# Altium schematic sheet Channel_1.SchDoc
size A4
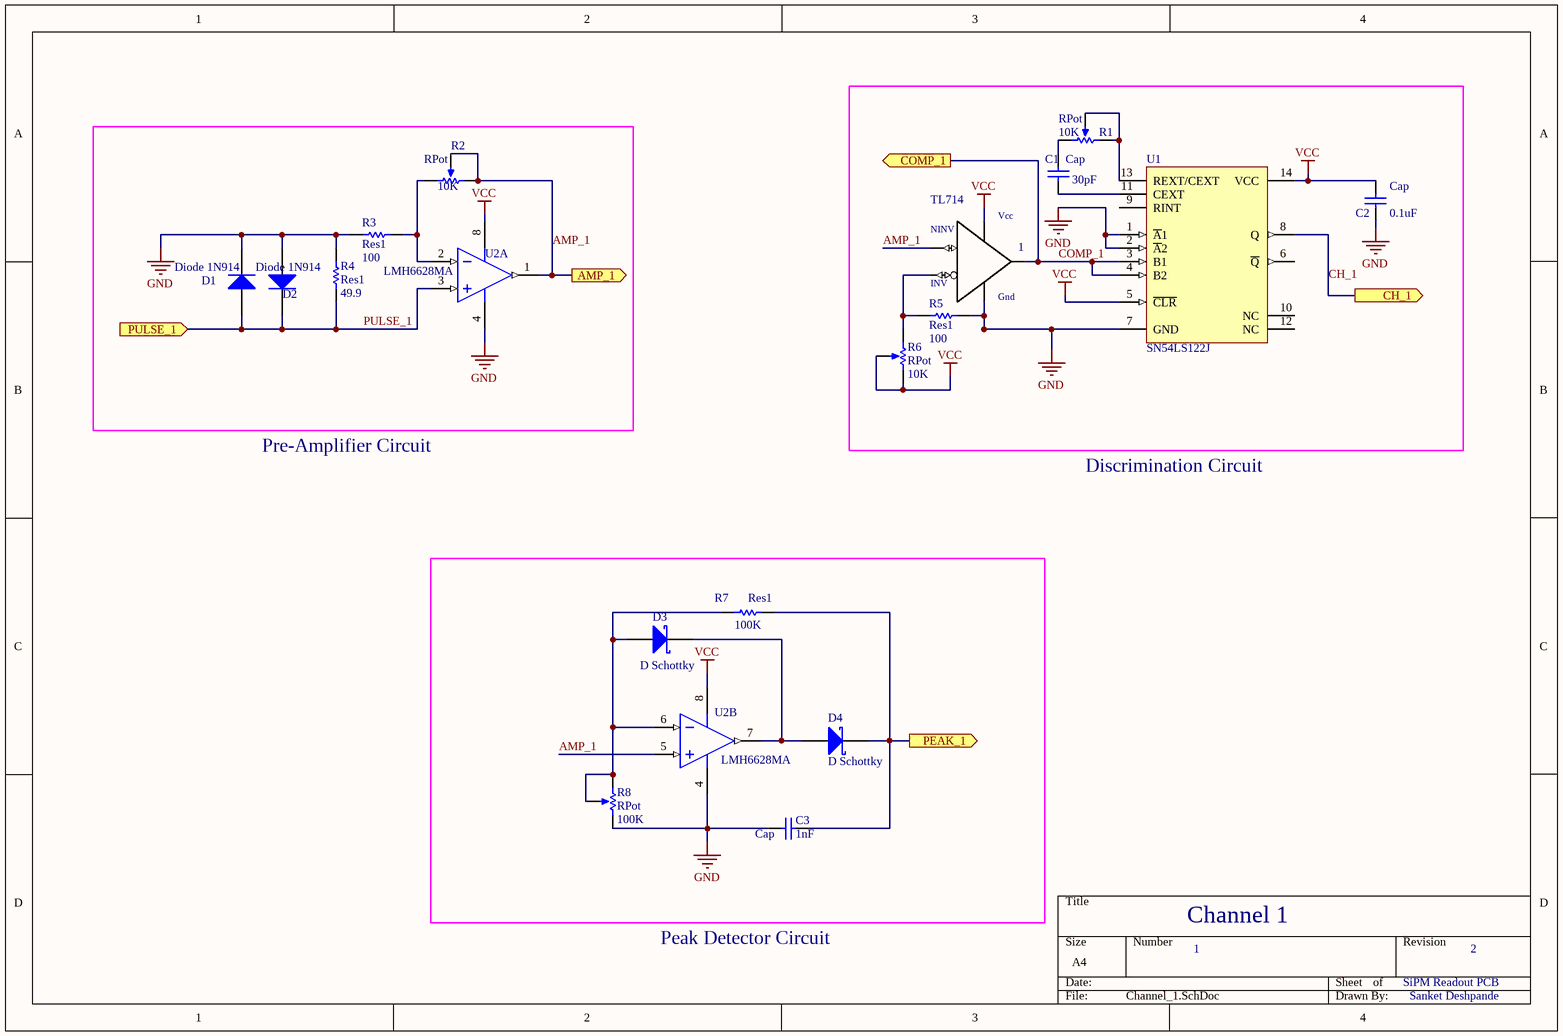
[diagram p0: Channel_1.SchDoc]

## Parts
1  TL714  [SO-08M]
C1  Cap  value 30pF  [RAD-0.3]
C2  Cap  value 0.1uF  [RAD-0.3]
C3  Cap  value 1nF  [RAD-0.3]
D1  Diode 1N914  [DO-35]
D2  Diode 1N914  [DO-35]
D3  D Schottky  [SMB]
D4  D Schottky  [SMB]
R1  RPot  value 10K  [VR5]
R2  RPot  value 10K  [VR5]
R3  Res1  value 100  [AXIAL-0.3]
R4  Res1  value 49.9  [AXIAL-0.3]
R5  Res1  value 100  [AXIAL-0.3]
R6  RPot  value 10K  [VR5]
R7  Res1  value 100K  [AXIAL-0.3]
R8  RPot  value 100K  [VR5]
U1  SN54LS122J  [J014]
U2  LMH6628MA  [M08A_N]  (parts A,B of 2)

## Ports
AMP_1 (out), CH_1 (out), COMP_1 (out), PEAK_1 (out), PULSE_1 (in)

## Nets
GND: 1.5(VNEG) C2.1 C3.1 D1.2(K) D2.1(A) R3.1 R4.1 R5.2 R8.2(BOT) U1.1(~{A}1) U1.2(~{A}2) U1.7(GND) U2.4(V-)
VCC: 1.8(VPOS) C2.2 R6.2(BOT) R6.3(TAP) U1.5(~{CLR}) U1.14(VCC) U2.8(V+)
AMP_1: 1.3(NINV) R2.1(TOP) R2.3(TAP) U2.1(OUT1) U2.5(IN2+) ; port AMP_1
CH_1: U1.8(Q) ; port CH_1
COMP_1: 1.6(OUT) U1.3(B1) U1.4(B2) ; port COMP_1
PEAK_1: C3.2 D4.2(K) R7.2 ; port PEAK_1
PULSE_1: D1.1(A) D2.2(K) R4.2 U2.3(IN1+) ; port PULSE_1
Net1_2: 1.2(INV) R5.1 R6.1(TOP)
NetC1_1: C1.1 U1.11(CEXT)
NetC1_2: C1.2 R1.2(BOT)
NetD3_1: D3.1(A) R7.1 R8.1(TOP) R8.3(TAP) U2.6(IN2-)
NetD3_2: D3.2(K) D4.1(A) U2.7(OUT2)
NetR1_1: R1.1(TOP) R1.3(TAP) U1.13(REXT/CEXT)
NetR2_2: R2.2(BOT) R3.2 U2.2(IN1-)

Not connected (* = marked no-connect by the designer): U1 6(~{Q}) 9(RINT) 10(NC) 12(NC)

## Notes on the sheet
- Pre-Amplifier Circuit
- Discrimination Circuit
- Channel 1
- Peak Detector Circuit
- 1
- SiPM Readout PCB
- 2
- Sanket Deshpande
- (in symbol TL714) Vcc; Gnd

## Library data of the parts
1 = TL714: The TL714C is a high-speed differential comparator fabricated with bipolar Schottky process technology. The circuit h...; MF: Texas Instruments; SnapEDA_Link: https://www.snapeda.com/parts/TL714/Texas%20Instruments/view-part/?ref=snap; Availability: Unavailable; MP: TL714; Package: None; Price: None; Value: *
C1-C3 = Cap: Capacitor; Published: 8-Jun-2000; LatestRevisionDate: 17-Jul-2002; LatestRevisionNote: Re-released for DXP Platform.; PackageReference: RAD-0.3; Publisher: Altium Limited; PackageDescription: Radial Cap, Thru-Hole; 2 Leads; 0.3 in Pin Spacing
D1 D2 = Diode 1N914: High Conductance Fast Diode; Published: 8-Jun-2000; LatestRevisionDate: 17-Jul-2002; LatestRevisionNote: Re-released for DXP Platform.; DatasheetVersion: 1997; PackageReference: DO-35; Publisher: Altium Limited; PackageDescription: Diode, Axial; Body 3.8 x 1.9 mm (LxDia. max), Lead Dia. 0.53 mm (max); Code_JEDEC: DO-204-AH; ComponentLink1Description: Manufacturer Link; ComponentLink1URL: http://www.fairchildsemi.com/; ComponentLink2Description: Datasheet; ComponentLink2URL: http://www.fairchildsemi.com/ds/1N%2F1N4448.pdf
D3 D4 = D Schottky: Schottky Diode; Published: 8-Jun-2000; LatestRevisionDate: 17-Jul-2002; LatestRevisionNote: Re-released for DXP Platform.; PackageReference: SMB; Publisher: Altium Limited; PackageDescription: DO-214-AA/SMB; 2 C-Bend Leads; Body 5.3 x 3.6 mm, inc. leads (LxW); Code_JEDEC: DO-214-AA
R1 R2 R6 R8 = RPot: Potentiometer; Sim Note: Enter the Resistance value and the set point into parameter fields.; Set Position: 0.5; Published: 8-Jun-2000; LatestRevisionDate: 17-Jul-2002; LatestRevisionNote: Re-released for DXP Platform.; PackageReference: VR5; Publisher: Altium Limited; PackageDescription: Variable Resistor, Thru-Hole; 3 Leads
R3-R5 R7 = Res1: Resistor; Published: 8-Jun-2000; LatestRevisionDate: 17-Jul-2002; LatestRevisionNote: Re-released for DXP Platform.; PackageReference: AXIAL-0.3; Publisher: Altium Limited; PackageDescription: Axial Device, Thru-Hole; 2 Leads; 0.3 in Pin Spacing
U1 = SN54LS122J: Retriggerable Monostable Multivibrator; Note: Pins No 10 and 12 are not connected and not drawn; Published: 8-Jun-2000; LatestRevisionDate: 04-Mar-2005; LatestRevisionNote: Stylized 3D Model Added.; DatasheetVersion: Mar-1988; PackageVersion: Jun-1999; PackageReference: J014; Publisher: Altium Limited; PackageDescription: DIP; 14 Leads; Row Spacing 7.62 mm; Pitch 2.54 mm; ComponentLink1Description: Manufacturer Link; ComponentLink1URL: http://www.ti.com/; ComponentLink2Description: Datasheet; ComponentLink2URL: http://www-s.ti.com/sc/ds/sn54ls123.pdf
U2 = LMH6628MA: Dual Wideband, Low Noise, Voltage Feedback Op Amp, 8-pin Narrow SOIC; Manufacturer: National Semiconductor; PackageTopMarking: NSZXTT*LMH66*28MA; PowerWise: Y; CompType: Amplifiers; DatasheetVersion: May-2005; PackageVersion: revM, May-2009; PackageReference: M08A; PackageDescription: SOIC Narrow, 4.9 x 3.9 x 1.45mm, 8 Lead, 1.27mm Pitch; PartNumber: LMH6628MA; RoHS: N; PinCount: 8; High-Reliability: Y; Code_JEDEC: MS-012-AA; Code_IPC: SOIC127P600-8; ComponentLink1Description: Manufacturer URL; ComponentLink1URL: http://www.national.com/; ComponentLink2Description: LMH6628 Datasheet; ComponentLink2URL: http://www.national.com/ds/LM/LMH6628.pdf; ComponentLink3Description: LMH6628 Web Page; ComponentLink3URL: http://www.national.com/pf/LM/LMH6628.html; ComponentLink4Description: M08A Package Page; ComponentLink4URL: http://www.national.com/packaging/folders/m08a.html